# Altium project AutoCatFeederPCB.PrjPcb
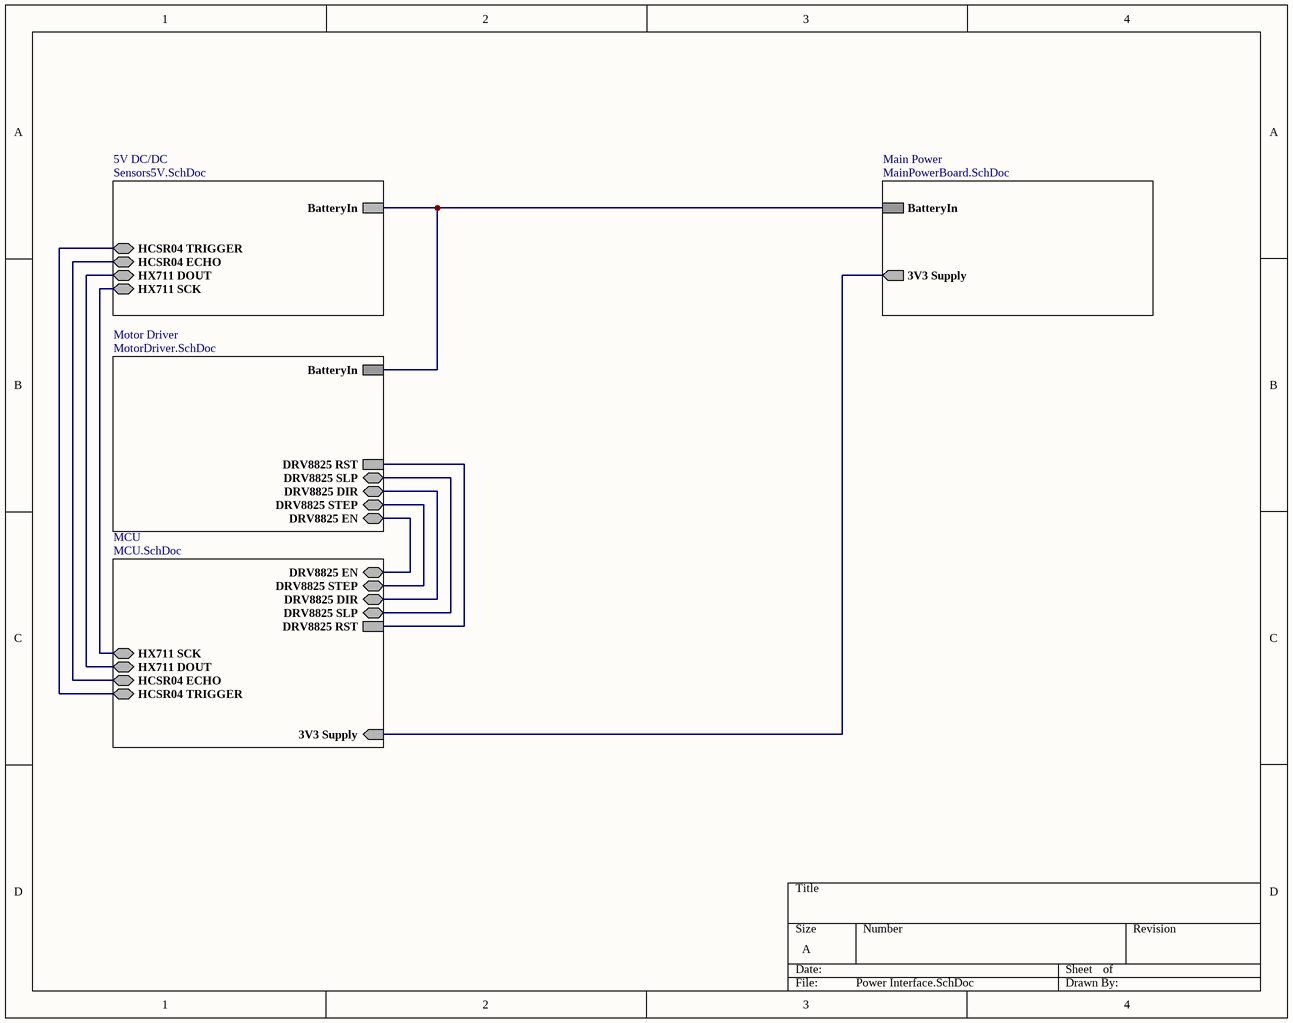
[diagram p0: Power Interface.SchDoc]
6 sheets, 91 parts. Net scope: hierarchical (ports join the sheet entries above them; power ports are global).
Board file: PCB1.PcbDoc
Sheets:
  Power Interface.SchDoc
    5V DC/DC = Sensors5V.SchDoc
    Main Power = MainPowerBoard.SchDoc
    Motor Driver = MotorDriver.SchDoc
    MCU = MCU.SchDoc
  Rechargeable Circuit.SchDoc

## Sheet Power Interface.SchDoc
size A; SheetNumber: 1; SheetTotal: 5

### Sub-sheets
5V DC/DC = Sensors5V.SchDoc: BatteryIn, HX711 DOUT (bidir), HX711 SCK (bidir), HCSR04 ECHO (bidir), HCSR04 TRIGGER (bidir)
Main Power = MainPowerBoard.SchDoc: BatteryIn, 3V3 Supply (out)
MCU = MCU.SchDoc: 3V3 Supply (in), DRV8825 EN (bidir), DRV8825 STEP (bidir), DRV8825 SLP (bidir), DRV8825 DIR (bidir), DRV8825 RST, HX711 SCK (bidir), HX711 DOUT (bidir), HCSR04 ECHO (bidir), HCSR04 TRIGGER (bidir)
Motor Driver = MotorDriver.SchDoc: BatteryIn, DRV8825 EN (bidir), DRV8825 STEP (bidir), DRV8825 DIR (bidir), DRV8825 SLP (bidir), DRV8825 RST

### Nets
NetC4_2: sheet 5V DC/DC/BatteryIn, sheet Main Power/BatteryIn, sheet Motor Driver/BatteryIn
NetC11_1: sheet Main Power/3V3 Supply, sheet MCU/3V3 Supply
NetMD1_2: sheet Motor Driver/DRV8825 RST, sheet MCU/DRV8825 RST
NetMD1_12: sheet Motor Driver/DRV8825 EN, sheet MCU/DRV8825 EN
NetMD1_13: sheet Motor Driver/DRV8825 STEP, sheet MCU/DRV8825 STEP
NetMD1_14: sheet Motor Driver/DRV8825 DIR, sheet MCU/DRV8825 DIR
NetMD1_16: sheet Motor Driver/DRV8825 SLP, sheet MCU/DRV8825 SLP
NetMD1_26: sheet 5V DC/DC/HX711 DOUT, sheet MCU/HX711 DOUT
NetMD1_29: sheet 5V DC/DC/HCSR04 TRIGGER, sheet MCU/HCSR04 TRIGGER
NetMD1_30: sheet 5V DC/DC/HCSR04 ECHO, sheet MCU/HCSR04 ECHO
NetMD1_33: sheet 5V DC/DC/HX711 SCK, sheet MCU/HX711 SCK

## Sheet Sensors5V.SchDoc
size A; SheetNumber: 3; SheetTotal: 5
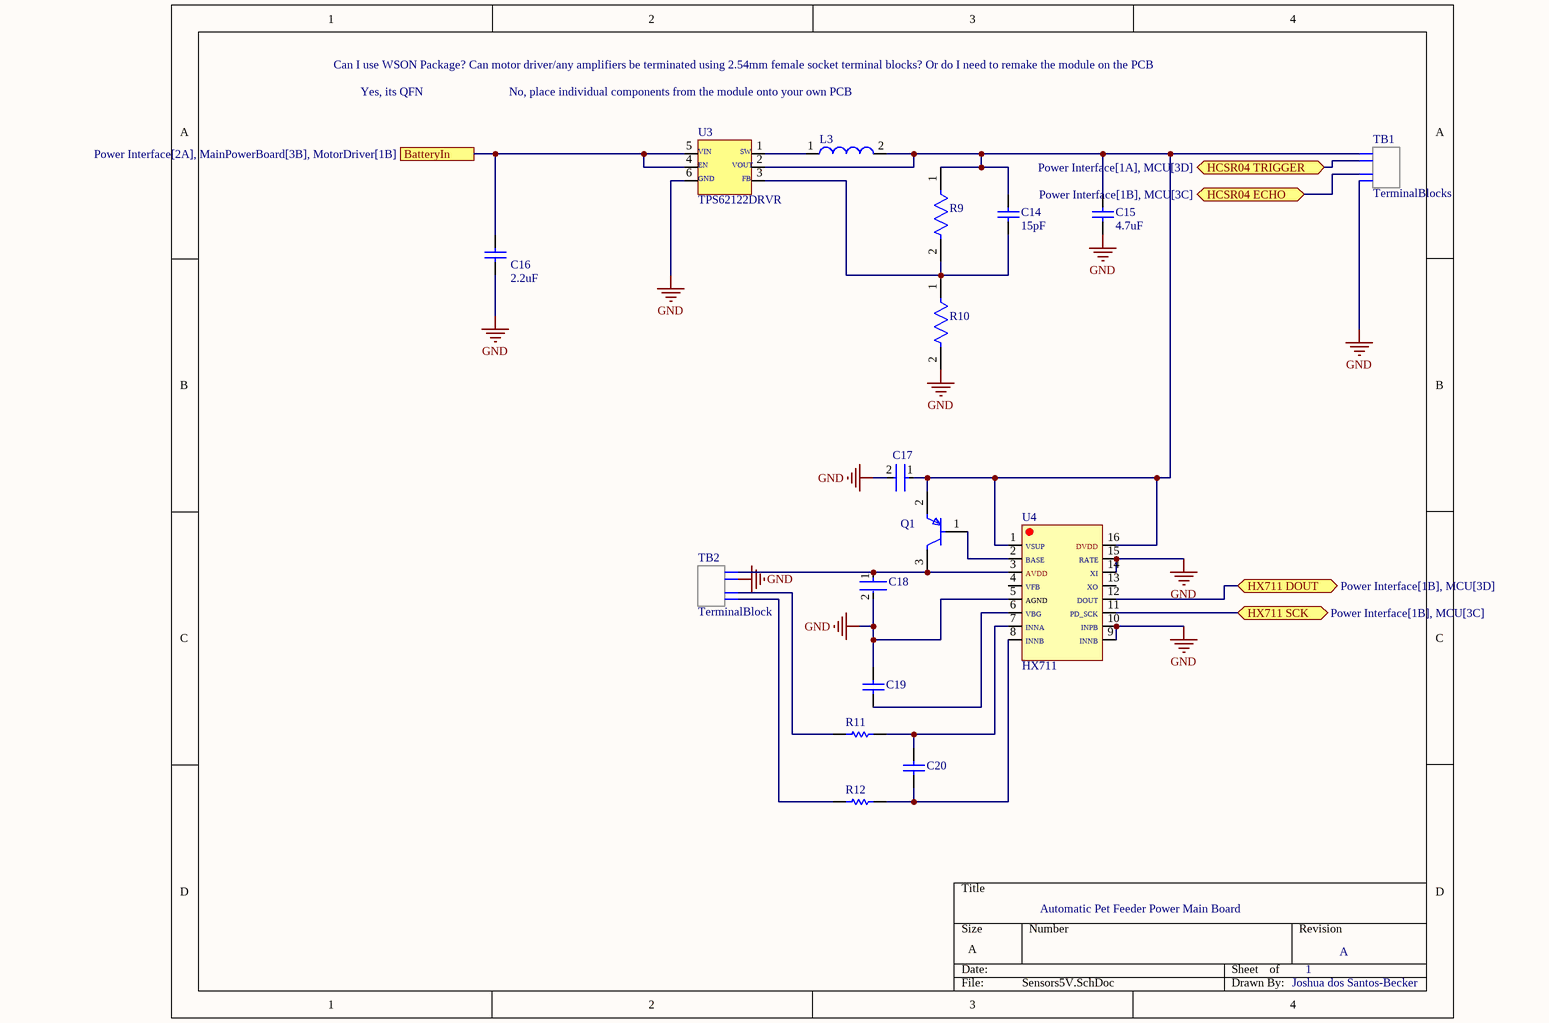
[diagram p1: Sensors5V.SchDoc]

### Parts
C14  15pF  [CAP_0805]
C15  4.7uF  [CAPC1005X06N]
C16  2.2uF  [CAPC0402X02N]
C17  GRM21BR61C106KE15L  [FP-GRM21B-0_1-IPC_C]  (value not drawn)
C18  GRM21BR61C106KE15L  [FP-GRM21B-0_1-IPC_C]  (value not drawn)
C19  GRM033C71C104KE14J  [CAPC0603X33N]  (value not drawn)
C20  GRM033C71C104KE14J  [CAPC0603X33N]  (value not drawn)
L3  (no value)  [FP-CB2012-IPC_A]
Q1  MMSS8550-H-TP  [FP-SOT-23-IPC_B]  (value not drawn)
R9  (no value)  [RESC0603(1608)_N]
R10  (no value)  [RESC1608X55X25LL10T15]
R11  ERJ-2RKF1000X  [RESC1005X40X25LL05T05]  (value not drawn)
R12  ERJ-2RKF1000X  [RESC1005X40X25LL05T05]  (value not drawn)
TB1  TerminalBlocks  [PHOENIX_1725672]
TB2  TerminalBlock  [PHOENIX_1725672]
U3  TPS62122DRVR  [PSON65P200X80_HS-7N]
U4  HX711  [TSOP127P600X160-16N]

### Ports
BatteryIn (see Power Interface[2A], MainPowerBoard[3B], MotorDriver[1B]), HCSR04 ECHO (bidir, see Power Interface[1B], MCU[3C]), HCSR04 TRIGGER (bidir, see Power Interface[1A], MCU[3D]), HX711 DOUT (bidir, see Power Interface[1B], MCU[3D]), HX711 SCK (bidir, see Power Interface[1B], MCU[3C])

### Nets
GND: C15.1 C16.1 C17.2 C18.2 C19.2 R10.2 TB1.4 TB2.3 U3.6 U4.5 U4.9 U4.10 U4.14 U4.15
NetC4_2: C16.2 U3.4 U3.5 ; port BatteryIn
NetC14_1: C14.1 R9.2 R10.1 U3.3
NetC14_2: C14.2 C15.2 C17.1 L3.2 Q1.2(E) R9.1 TB1.1 U3.2 U4.1 U4.16
NetC18_1: C18.1 Q1.3(C) TB2.4 U4.3
NetC19_1: C19.1 U4.6
NetC20_1: C20.1 R12.2 U4.8
NetC20_2: C20.2 R11.2 U4.7
NetL3_1: L3.1 U3.1
NetMD1_26: U4.12 ; port HX711 DOUT
NetMD1_29: TB1.2 ; port HCSR04 TRIGGER
NetMD1_30: TB1.3 ; port HCSR04 ECHO
NetMD1_33: U4.11 ; port HX711 SCK
NetQ1_1: Q1.1(B) U4.2
NetR11_1: R11.1 TB2.2
NetR12_1: R12.1 TB2.1

Not connected (* = marked no-connect by the designer): U4 4 13

### Notes on the sheet
- Can I use WSON Package? Can motor driver/any amplifiers be terminated using 2.54mm female socket terminal blocks? Or do I need to remake the module on the PCB
- Yes, its QFN
- No, place individual components from the module onto your own PCB
- Automatic Pet Feeder Power Main Board
- 1
- A
- Joshua dos Santos-Becker
- (in symbol HX711) VSUP; DVDD; BASE; RATE; AVDD; XI; VFB; XO; AGND; DOUT; VBG; PD_SCK; INNA; INPB; INNB
- (in symbol TPS6212) VIN; SW; EN; VOUT; GND; FB

### Library data of the parts
C14 = Cff: CC0805JRNPO9BN150
C15 = Cout2: GRM155R61A475MEAAD
C16 = Cin2: C1005X5R1V225K050BC
C17 C18 = CMP-2007-03453-2: Chip Multilayer Ceramic Capacitors for General Purpose, 0805, 10uF, X5R, 15%, 10%, 16V; Radiation Hardening: No; Thickness: 0.053inch; Voltage Rating (DC): 16V; Lead Free: Lead Free; Package Quantity: 1; Width: 1.25mm; Case Code (Imperial): 0805; Depth: 1.25mm; Packaging: Tape and Reel; Dielectric: X5R; Max Operating Temperature: 85°C; Tolerance: 10%; Voltage Rating: 16V; Voltage: 16V; Capacitance: 10uF; Height: 1.25mm; Case Code (Metric): 2012; Material: Ceramic; Mount: Surface Mount; Case/Package: 0805; REACH SVHC: No SVHC; Length: 2mm; Min Operating Temperature: -55°C; Termination: SMD/SMT
C19 C20 = 0.1uF: Manufacturer_Name: Murata Electronics; Geometry.Height: 0.33mm; Mouser Part Number: 81-GRM033C71C104KE4J; Mouser Price/Stock: https://www.mouser.co.uk/ProductDetail/Murata-Electronics/GRM033C71C104KE14J?qs=QzBtWTOodeU72T%252BpeIULSA%3D%3D; Manufacturer_Part_Number: GRM033C71C104KE14J; Datasheet Link: http://www.murata.com/~/media/webrenewal/support/library/catalog/products/capacitor/mlcc/c02e.pdf
L3 = L1: CBC2012T220M; Inductance: 22uH; Current Rating: 190mA; Self Resonant Frequency: 16MHz; DC Resistance (DCR): 4.81R; Tolerance: 20%; Max DC Current: 170mA; Shielding: Unshielded; Test Frequency: 2.52MHz; Core Material: Ferrite; Package Quantity: 3000; Height - Seated (Max): 0.057inch; Lead Free: Exempt; Width: 0.049inch; Length: 0.079inch; Max Operating Temperature: 105°C; Number of Pins: 2; Height: 1.25mm; Packaging: Tape and Reel; Saturation Current: 170mA; Mount: Surface Mount; Case Code (Metric): 2012; Series: CB; Halogen Free: Halogen Free; Min Operating Temperature: -40°C; Case Code (Imperial): 0805; Case/Package: 0805; Termination: SMD/SMT; RoHS Compliant: Yes; Resistor Type: Wirewound
Q1 = CMP-56214-000002-1: TRANS PNP 25V 1.5A SOT23; Emitter Base Voltage (VEBO): 1.6V; Collector Base Voltage (VCBO): 40V; Collector Emitter Saturation Voltage: 500mV; Max Power Dissipation: 625mW; Transition Frequency: 100MHz; Element Configuration: Single; hFE Min: 40; Polarity: PNP; Lead Free: Lead Free; Max Breakdown Voltage: 25V; Package Quantity: 1; Min Operating Temperature: -55°C; Case/Package: SOT-23; Max Collector Current: 1.5A; Mount: Surface Mount; Packaging: Tape and Reel; Collector Emitter Voltage (VCEO): 500mV; Max Operating Temperature: 150°C; Gain Bandwidth Product: 100MHz; Collector Emitter Breakdown Voltage: 25V
R9 = RES: RC0603FR-07430KL; Case-Metric: 1608; Power: 0.1 W; Case-EIA: 0603; Tolerance: 1 %; Value: 430000.00 Ohm; Technology: SMT
R10 = RES-2: RC0603FR-0782KL; Manufacturer: Yageo; Temperature Coefficient: 100PPM/C; Unit Weight: 0.000071oz; Voltage Rating: 75V; Resistance: 82kOhms; Power Rating: 100mW; Tolerance: 1%; Packaging: Reel; Package Description: 2-Pin Surface Mount Device, Body 1.6 x 0.8 mm; Package / Case: 0603(1608metric); Series: RC; Operating Temperature Range: -55Cto+155C; Brand: Yageo; Case Code - in: 0603; Width: 0.8mm; Height: 0.45mm; Product Category: ThickFilmResistors; Length: 1.6mm; Product: ThickFilmResistorsGeneralPurpose; Manufacturer URL: http://www.yageo.com/; Datasheet URL: http://www.yageo.com/documents/recent/PYu-RC_Group_51_RoHS_L_7.pdf; RoHS: True; Datasheet Version: Rev. 7, 05/2017; Case Code - mm: 1608; Package Reference: 0603; Mounting Technology: SurfaceMount; Type: GeneralPurposeChipResistorSurfaceMount; Termination Style: SMD/SMT
R11 R12 = CMP-2002-00605-3: Chip Resistor, 100 Ohm, +/- 1%, 100 mW, -55 to 155 degC, 0402 (1005 Metric), RoHS, Tape and Reel; Manufacturer: Basic Passives; Power Rating: 100 mW; Resistance: 100 Ohm; Voltage Rating: 50 V; Case\/Package: 0402; Width: 0.5 mm; Pins: 2; ComponentLink2Description: Datasheet; PackageReference: 0402; Height: 0.35 mm; Tolerance: 1%; DatasheetVersion: 04/2015; Case Code (Imperial): 0402; Min Operating Temperature: -55 degC; Radiation Hardening: No; Length: 1 mm; Package Quantity: 10000; PackageDescription: 2-Pin Surface Mount Device, Body 1 x 0.5 mm; Mounting Technology: Surface Mount; Case Code (Metric): 1005; Packaging: Tape and Reel; ComponentLink1URL: http://www.panasonic.com/; RoHSCompliant: true; Max Operating Temperature: 155 degC; REACH SVHC: Yes; PartNumber: ERJ-2RKF1000X; ComponentLink1Description: Manufacturer URL; ComponentLink2URL: http://industrial.panasonic.com/cdbs/www-data/pdf/RDA0000/AOA0000C86.pdf; Mount: Surface Mount
TB1 = TerminalBlock
U3 = TPS6212

## Sheet MainPowerBoard.SchDoc
size B; SheetNumber: 2; SheetTotal: 5
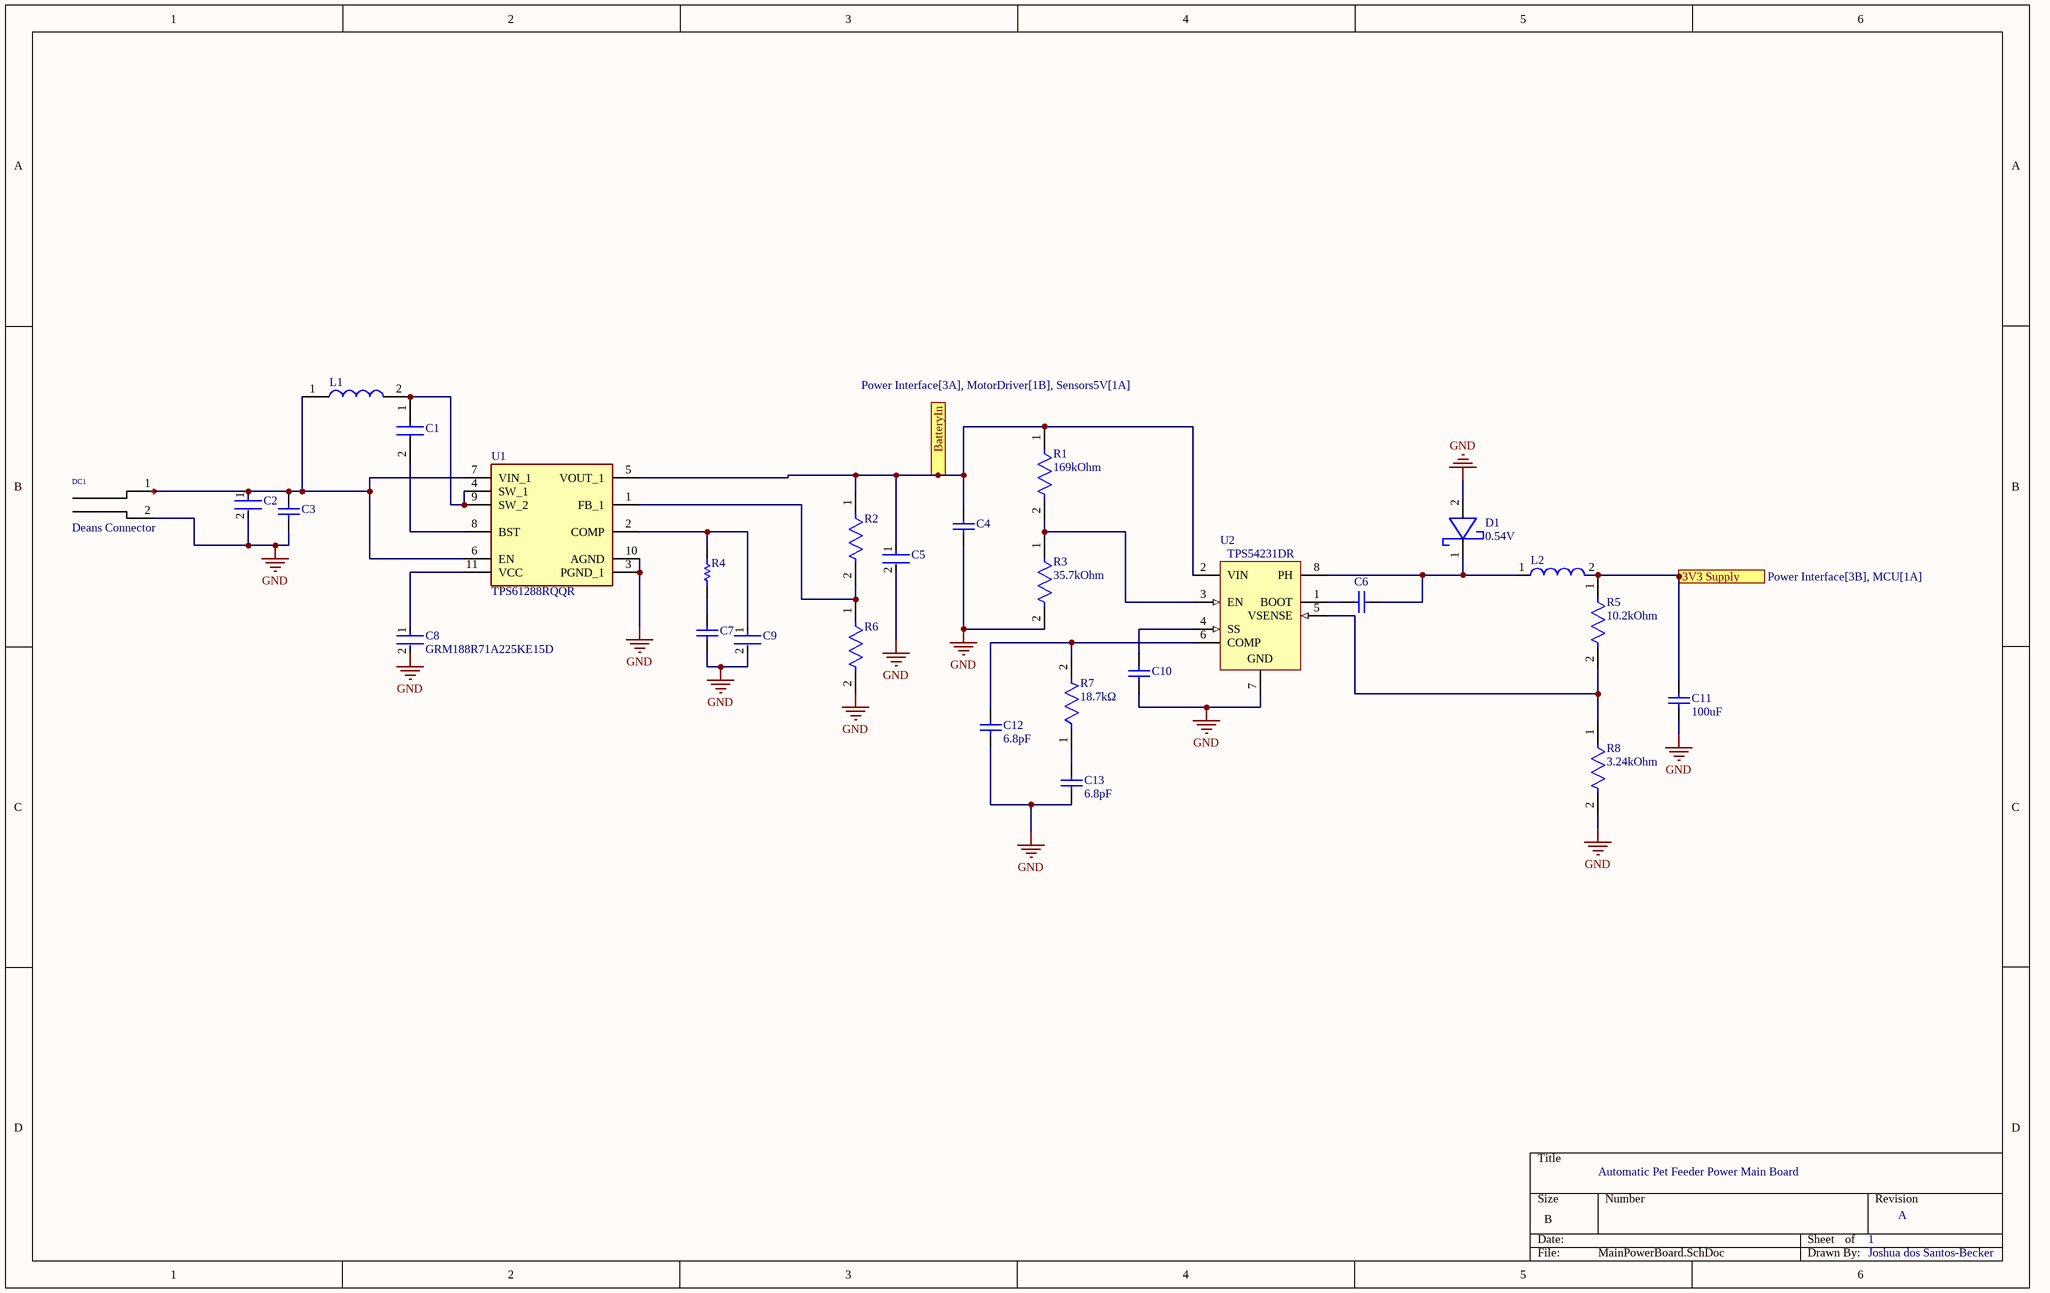
[diagram p2: MainPowerBoard.SchDoc]

### Parts
C1  EMK107B7104KA-T  [CAPC1608X95N]  (value not drawn)
C2  GRM188R60J106ME47D  [FP-GRM188-0_1-e0_2_0_55-IPC_A]  (value not drawn)
C3  GRM188R71H104KA93D  [CAPC1608X90X35ML10T15]  (value not drawn)
C4  (no value)  [FP-GRM32-IPC_A]
C5  GRM32ER61C476KE15L  [FP-GRM32E-0_3-0_2-IPC_C]  (value not drawn)
C6  (no value)  [CAPC1005X55X25LL05T10]
C7  GRM155R61A393KA01D  [CAPC1005X55X25NL05T10]  (value not drawn)
C8  GRM188R71A225KE15D  [FP-GRM188-0_1-e0_2_0_5-MFG]
C9  CL21C101JBANNNC  [FP-CL21-IPC_C]  (value not drawn)
C10  (no value)  [CAPC1005X55X25LL05T10]
C11  100uF  [CAP_0805]
C12  6.8pF  [Ccomp2]
C13  6.8pF  [Ccomp]
D1  0.54V  [SODFL260X100-2N]
DC1  Deans Connector  [Deans]
L1  XAL7070-222MEB  [XAL7070332MEB]  (value not drawn)
L2  (no value)  [WE-TI-L]
R1  169kOhm  [FP-CRCW0402-e3-IPC_B]
R2  CRCW0805931KFKEA  [RESC2012X50N]  (value not drawn)
R3  35.7kOhm  [FP-CRCW0402-e3-MFG]
R4  CRCW060339K2FKEA  [RESC1609X50X30LL10T20]  (value not drawn)
R5  10.2kOhm  [FP-CRCW0402-e3-MFG]
R6  CRCW080548K7FKEA  [FP-CRCW0805-e3-IPC_A]  (value not drawn)
R7  18.7kΩ  [FP-AC0402-IPC_A]
R8  3.24kOhm  [FP-CRCW0402-e3-MFG]
U1  TPS61288RQQR  [TPS61288RQQR]
U2  TPS54231DR  [D0008A_L]

### Ports
3V3 Supply (out, see Power Interface[3B], MCU[1A]), BatteryIn (see Power Interface[3A], MotorDriver[1B], Sensors5V[1A])

### Nets
GND: C2.2 C3.1 C4.1 C5.2 C7.2 C8.2 C9.2 C10.2 C11.2 C12.1 C13.2 D1.2 DC1.2 R3.2 R6.2 R8.2 U1.3(PGND_1) U1.10(AGND) U2.7(GND)
NetC1_1: C1.1 L1.2 U1.4(SW_1) U1.9(SW_2)
NetC1_2: C1.2 U1.8(BST)
NetC2_1: C2.1 C3.2 DC1.1 L1.1 U1.6(EN) U1.7(VIN_1)
NetC4_2: C4.2 C5.1 R1.1 R2.1 U1.5(VOUT_1) U2.2(VIN) ; port BatteryIn
NetC6_1: C6.1 U2.1(BOOT)
NetC6_2: C6.2 D1.1 L2.1 U2.8(PH)
NetC7_1: C7.1 R4.2
NetC8_1: C8.1 U1.11(VCC)
NetC9_1: C9.1 R4.1 U1.2(COMP)
NetC10_1: C10.1 U2.4(SS)
NetC11_1: C11.1 L2.2 R5.1 ; port 3V3 Supply
NetC12_2: C12.2 R7.2 U2.6(COMP)
NetC13_1: C13.1 R7.1
NetR1_2: R1.2 R3.1 U2.3(EN)
NetR2_2: R2.2 R6.1 U1.1(FB_1)
NetR5_2: R5.2 R8.1 U2.5(VSENSE)

### Notes on the sheet
- Automatic Pet Feeder Power Main Board
- 1
- A
- Joshua dos Santos-Becker

### Library data of the parts
C1 = EMK107B7104KA-T: Capacitor; Manufacturer_Name: TAIYO YUDEN; Datasheet Link: http://www.farnell.com/datasheets/746258.pdf; Height: 0.95mm; Manufacturer_Part_Number: EMK107B7104KA-T; Mouser Part Number: 963-EMK107B7104KA-T; Mouser Price/Stock: https://www.mouser.co.uk/ProductDetail/TAIYO-YUDEN/EMK107B7104KA-T?qs=I6KAKw0tg2ybqzX8hKPgfw%3D%3D; Arrow Part Number: EMK107B7104KA-T; Arrow Price/Stock: https://www.arrow.com/en/products/emk107b7104ka-t/taiyo-yuden
C2 = CMP-2006-02792-2: Chip Multilayer Ceramic Capacitors for General Purpose, 0603, 10uF, X5R, 15%, 20%, 6.3V; Packaging: Tape and Reel; Voltage Rating (DC): 6.3V; Width: 0.031inch; Termination: SMD/SMT; Dielectric: X5R; Package Quantity: 4000; Voltage Rating: 6.3V; Capacitance: 10uF; Case/Package: 0603; Min Operating Temperature: -55°C; Voltage: 6.3V; Length: 1.6mm; Thickness: 0.035inch; Lead Free: Lead Free; Depth: 0.8mm; Case Code (Imperial): 0603; Max Operating Temperature: 85°C; Material: Ceramic; Height: 0.8mm; Tolerance: 20%; Mount: Surface Mount; REACH SVHC: No SVHC; Radiation Hardening: No; Case Code (Metric): 1608
C3 = CMP-2100-03643-1: Chip Capacitor, 0.1 uF, +/- 10%, 50 V, -55 to 125 degC, 0603 (1608 Metric), RoHS, Tape and Reel; Manufacturer: Murata; Dielectric Material: Ceramic; Voltage Rating: 50V; Capacitance: 100nF; Dielectric: X7R; Insulation Resistance: 10GR; Case Code (Metric): 1608; Lead Free: LeadFree; Depth: 0.8mm; Number of Pins: 2; Radiation Hardening: No; Case/Package: 0603; Manufacturer URL: http://www.murata.com/; Packaging: TapeandReel; Length: 1.6mm; Contact Plating: Tin; Datasheet URL: http://psearch.en.murata.com/capacitor/product/GRM188R71H104KA93%23.pdf; Tolerance: 10%; Case Code (Imperial): 0603; Min Operating Temperature: -55degC; RoHSCompliant: true; Voltage: 50V; Termination: SMD/SMT; Mount: SurfaceMount; Material: Ceramic; Package Quantity: 1; Height: 0.8mm; Thickness: 0.035inch; REACH SVHC: NoSVHC; Max Operating Temperature: 125degC; Width: 0.8mm; Package Reference: 0603; Voltage Rating (DC): 50V; Datasheet Version: 42675.0; Package Description: 2-Pin Surface Mount Device, Body 1.6 x 0.8 mm
C4 = Cin: GRM32ER61E226KE15L; Manufacturer: Murata Electronics North America; Temperature Characteristic: X5R; Possible Substitute: GRM32ER61E226KE15K; Other Names: 490-3889-2; Material: Ceramic; Capacitance: 22uF; Value: 22uF; Voltage - Rated: 25V; Tolerance: 10%; Digikey Description: CAP CER 22UF 25V X5R 1210; Mouser Description: Multilayer Ceramic Capacitors MLCC - SMD/SMT 1210 22uF 25volts X5R 10%; Device Class L2: Capacitors; Height: 2.7mm; Category: Cap; RoHS: TRUE; Operating Temperature: -55°C ~ 85°C; Temperature: -55°C to +85°C; Lead Free: Yes; Package: GRM32; Temperature Range High: +85°C; Package / Case: 1210 (3225 Metric); Standard Package: 1,000; Packaging: Cut Tape (CT); Thickness (Max): 0.106" (2.70mm); Automotive: No; Device Class L1: Passive Components; Temperature Range Low: -55°C; Size / Dimension: 0.126" L x 0.098" W (3.20mm x 2.50mm); ComponentLink2Description: Datasheet; Device Class L3: Ceramic Capacitors; Temperature Coefficient: X5R; ComponentLink2URL: https://search.murata.co.jp/Ceramy/image/img/A01X/G101/ENG/GRM32ER61E226KE15-01A.pdf; Voltage Rating: 25V; Manufacturer Part Number: GRM32ER61E226KE15L; Octopart: https://octopart.com/grm32er61e226ke15l-murata-197441; Applications: General Purpose; Mounting Type: Surface Mount, MLCC
C5 = CMP-2000-06362-2: CAP CER 47UF 16V X5R 1210; Tolerance: 10%; Material: Ceramic; Case Code (Metric): 3225; RoHS Compliant: Yes; Min Operating Temperature: -55°C; Radiation Hardening: No; Voltage: 16V; Package Quantity: 1; Case Code (Imperial): 1210; REACH SVHC: No SVHC; Capacitance: 47uF; Voltage Rating (DC): 16V; Dielectric: X5R; Case/Package: 1210; Length: 3.2mm; Voltage Rating: 16V; Packaging: Cut Tape; Width: 0.098inch; Number of Pins: 2; Lead Free: Lead Free; Height: 2.5mm; Mount: Surface Mount; Termination: SMD/SMT; Max Operating Temperature: 85°C; Thickness: 0.106inch; Depth: 2.5mm
C6 = Cboot: GRM155R71A104KA01D; Manufacturer: Murata; Rated Voltage: 10V; Capacitance: 100000pF; Dielectric: X7R; Tolerance (%): ±10%; Manufacturer URL: http://www.murata.com/; Datasheet Version: 02/2016; Datasheet URL: http://search.murata.co.jp/Ceramy/image/img/A01X/G101/ENG/GRM155R71A104KA01-01.pdf; Package Reference: 0402; Package Description: 2-Pin Surface Mount Device, Body 1 x 0.5 mm; Mounting Technology: SurfaceMount; Case Size/Dimension: 0402
C7 = CMP-2008-04563-1: Manufacturer: Murata; Part Number: GRM155R61A393KA01D
C8 = CMP-2006-02836-2: Chip Multilayer Ceramic Capacitors for General Purpose, 0603, 2.2uF, X7R, 15%, 10%, 10V; Case Code (Metric): 1608; Height: 0.8mm; Packaging: Cut Tape; Voltage: 10V; Lead Free: Lead Free; Min Operating Temperature: -55°C; Voltage Rating (DC): 10V; Max Operating Temperature: 125°C; Voltage Rating: 10V; Dielectric: X7R; Depth: 0.8mm; Case Code (Imperial): 0603; Termination: SMD/SMT; Case/Package: 0603; Number of Pins: 2; REACH SVHC: No SVHC; Mount: Surface Mount; Width: 0.031inch; Material: Ceramic; Capacitance: 2.2uF; Package Quantity: 1; Weight: 7.1E-05oz; Length: 1.6mm; Thickness: 0.035inch; Tolerance: 10%
C9 = CMP-13271-001949-1: CL21 Series 0805 100pF 50V ±5% Tolerance C0G Multilayer Ceramic Chip Capacitor; Temperature Coefficient: 300ppm/°C; Voltage Rating (DC): 50V; Material: Ceramic; Capacitance: 100pF; Height: 0.65mm; Thickness: 0.03inch; Case/Package: 0805; Voltage Rating: 50V; Max Operating Temperature: 125°C; Voltage: 50V; Dielectric: C0G; Length: 2mm; Case Code (Metric): 2012; Packaging: Tape and Reel; Tolerance: 5%; Min Operating Temperature: -55°C; Radiation Hardening: No; Lead Free: Lead Free; Contact Plating: Tin; Width: 0.049inch; Mount: Surface Mount; Case Code (Imperial): 0805; Depth: 1.25mm
C10 = CSS: GRM155R71C822KA01D; Manufacturer: Murata; Part Number: GRM155R71C822KA01D
C11 = CAP_0805: Capacitor SMD 0805 Generic
C12 = Ccomp2: 06031U6R8BAT2A
C13 = Ccomp: 06031U6R8BAT2A
D1 = Schottky
L1 = XAL7070-222MEB: Inductor; Manufacturer_Name: COILCRAFT; Datasheet Link: https://www.coilcraft.com/xal7070.cfm; Height: 7mm; Manufacturer_Part_Number: XAL7070-222MEB; Mouser Part Number: 994-XAL7070-222MEB; Mouser Price/Stock: https://www.mouser.co.uk/ProductDetail/Coilcraft/XAL7070-222MEB?qs=VJjuEbE9QBOHvtnxhiSHKw%3D%3D
L2 = PAS-IND-INDUCTOR-2: 744772390; Inductance: 39.0 ÂµH; ComponentLink1Description: Manufacturer Link; ComponentLink1URL: http://www.we-online.com; PackageDescription: THT Inductor, 2-Leads, Body 7.8 x 7.8 mm; DatasheetVersion: ver 8, Oct-2009; ComponentLink2URL: http://www.we-online.de/katalog/media/pdf/744772390.pdf; PackageReference: WE-TI-L; PackageVersion: 2006; ComponentLink2Description: Datasheet
R1 = CMP-2002-08234-2: CRCW0402169KFKED; Max Power Dissipation: 63mW; Voltage Rating: 50V; Resistance: 169kR; Temperature Coefficient: 100ppm/°C; Tolerance: 1%; Max Operating Temperature: 155°C; Case/Package: 0402; Depth: 0.5mm; Number of Pins: 2; Lead Free: Lead Free; Radiation Hardening: No; Contact Plating: Tin; Width: 0.02inch; Number of Terminations: 2; Height: 0.35mm; Length: 1mm; Package Quantity: 10; Power Rating: 63mW; Packaging: Tape and Reel; Military Standard: Not; Case Code (Imperial): 0402; Weight: 2.3E-05oz; Voltage Rating (DC): 50V; Case Code (Metric): 1005; Composition: Thick Film; Features: Automotive AEC-Q200; Termination: SMD/SMT; Mount: Surface Mount; Min Operating Temperature: -55°C
R2 = CRCW0805931KFKEA: Resistor; Manufacturer_Name: Vishay; Datasheet Link: http://www.vishay.com/docs/20035/dcrcwe3.pdf; Height: 0.5mm; Manufacturer_Part_Number: CRCW0805931KFKEA; Mouser Part Number: 71-CRCW0805-931K-E3; Mouser Price/Stock: https://www.mouser.com/Search/Refine.aspx?Keyword=71-CRCW0805-931K-E3
R3 = CMP-2002-08543-2: CRCW040235K7FKED; Tolerance: 1%; Voltage Rating (DC): 50V; Power Rating: 63mW; Resistance: 35.7kR; Temperature Coefficient: 100ppm/°C; Case Code (Metric): 1005; Voltage Rating: 50V; Termination: SMD/SMT; Height: 0.35mm; Working Voltage: 50V; Width: 0.02inch; Min Operating Temperature: -55°C; Features: Automotive AEC-Q200; Radiation Hardening: No; Case/Package: 0402; Depth: 0.5mm; Lead Free: Lead Free; Contact Plating: Tin; Max Power Dissipation: 63mW; Max Operating Temperature: 155°C; Weight: 2.3E-05oz; Number of Pins: 2; Packaging: Tape and Reel; Number of Terminations: 2; Composition: Thick Film; Length: 1mm; Military Standard: Not; Package Quantity: 10; Case Code (Imperial): 0402
R4 = CMP-2000-03290-1: Manufacturer: Vishay Dale; Part Number: CRCW060339K2FKEA
R5 = CMP-2002-08138-2: CRCW040210K2FKED; Temperature Coefficient: 100ppm/°C; Power Rating: 63mW; Voltage Rating: 50V; Resistance: 10.2kR; Tolerance: 1%; Height: 0.35mm; Features: Automotive AEC-Q200; Contact Plating: Tin; Radiation Hardening: No; Width: 0.5mm; Case/Package: 0402; Depth: 0.5mm; Termination: SMD/SMT; Mount: Surface Mount; Packaging: Tape and Reel; Min Operating Temperature: -55°C; Package Quantity: 10; Number of Pins: 2; Composition: Thick Film; Length: 1mm; Max Power Dissipation: 63mW; Case Code (Imperial): 0402; Military Standard: Not; Case Code (Metric): 1005; Number of Terminations: 2; Weight: 2.3E-05oz; Max Operating Temperature: 155°C
R6 = CMP-2001-03948-2: RES Thick Film, 48.7kΩ, 1%, 0.125W, 100ppm/°C, 0805; Voltage Rating: 150V; Resistance: 48.7kR; Max Power Dissipation: 125mW; Military Standard: Not; Termination: SMD/SMT; Contact Plating: Tin; Min Operating Temperature: -55°C; Case Code (Metric): 2012; Width: 0.049inch; Temperature Coefficient: 100ppm/°C; Length: 2mm; Depth: 1.25mm; Packaging: Tape and Reel; Weight: 0.000194oz; Features: Automotive AEC-Q200; Number of Pins: 2; Max Operating Temperature: 155°C; Number of Terminations: 2; Case/Package: 0805; Lead Free: Lead Free; Tolerance: 1%; Case Code (Imperial): 0805; Package Quantity: 10; Voltage Rating (DC): 150V; Radiation Hardening: No; Power Rating: 125mW; Composition: Thick Film; Height: 0.45mm
R7 = CMP-03412-024020-2: AC0402FR-0718K7L; Tolerance: 1%; Max Power Dissipation: 63mW; Temperature Coefficient: 100ppm/°C; Resistance: 18.7kR; Resistor Type: Thick Film; Height: 0.015inch; Case/Package: 0402; Features: Moisture Resistant; Number of Terminations: 2; Min Operating Temperature: -55°C; Length: 0.039inch; RoHS Compliant: Yes; Packaging: Tape and Reel; Width: 0.02inch; Series: AC; Max Operating Temperature: 155°C
R8 = CMP-2002-08579-2: CRCW04023K24FKED; Voltage Rating: 50V; Max Power Dissipation: 63mW; Tolerance: 1%; Resistance: 3.24kR; Temperature Coefficient: 100ppm/°C; Packaging: Tape and Reel; Composition: Thick Film; Depth: 0.5mm; Weight: 2.3E-05oz; Number of Terminations: 2; Radiation Hardening: No; Voltage Rating (DC): 50V; Lead Free: Lead Free; Case Code (Metric): 1005; Height: 0.35mm; Width: 0.5mm; Max Operating Temperature: 155°C; Mount: Surface Mount; Package Quantity: 10; Number of Pins: 2; Min Operating Temperature: -55°C; Features: Automotive AEC-Q200; Case Code (Imperial): 0402; Power Rating: 63mW; Military Standard: Not; Contact Plating: Tin; Length: 1mm; Case/Package: 0402; Termination: SMD/SMT
U2 = CMP-0323-00207-3: Buck Step Down Regulator with 3.5 to 28 V Input and 0.8 to 25 V Output, -40 to 150 degC, 8-Pin SOIC (D), Green (RoHS & no Sb/Br); Manufacturer: Texas Instruments; Vout(Min)(V): 0.8; Iout(Max)(A): 2; SubFamily: Step-Down Regulator; Vin(Min)(V): 3.5; Rating: Catalog; Duty Cycle(Max)(%): 90; Switch Current Limit(Typ)(A): 2.3; Iq(Typ)(mA): 0.11; Regulated Outputs(#): 1; Vout(Max)(V): 25; Vin(Max)(V): 28; ComponentLink2Description: Package Specification; PackageVersion: revM, Jun-2011; Topology: Buck; PackageReference: D0008A; DatasheetVersion: SLUS851C; Code_JEDEC: MS-012AA; PartNumber: TPS54231DR; ComponentLink2URL: http://www.ti.com/litv/pdf/msoi002j; Eco-Plan: Green (RoHS & no Sb/Br); ComponentLink1URL: http://www.ti.com/general/docs/lit/getliterature.tsp?genericPartNumber=TPS54231&fileType=pdf; ComponentLink1Description: Datasheet; PackageDescription: 8-Pin Plastic Small Outline Integrated Circuit, 4.9 x 3.9 mm, Pitch 1.27 mm Pitch; ComponentLink3URL: Samples URL:http://www.ti.com/product/tps54231#samples; Mounting Technology: Surface Mount; ComponentLink3Description: URL Link1

## Sheet MotorDriver.SchDoc
size A; SheetNumber: 4; SheetTotal: 5
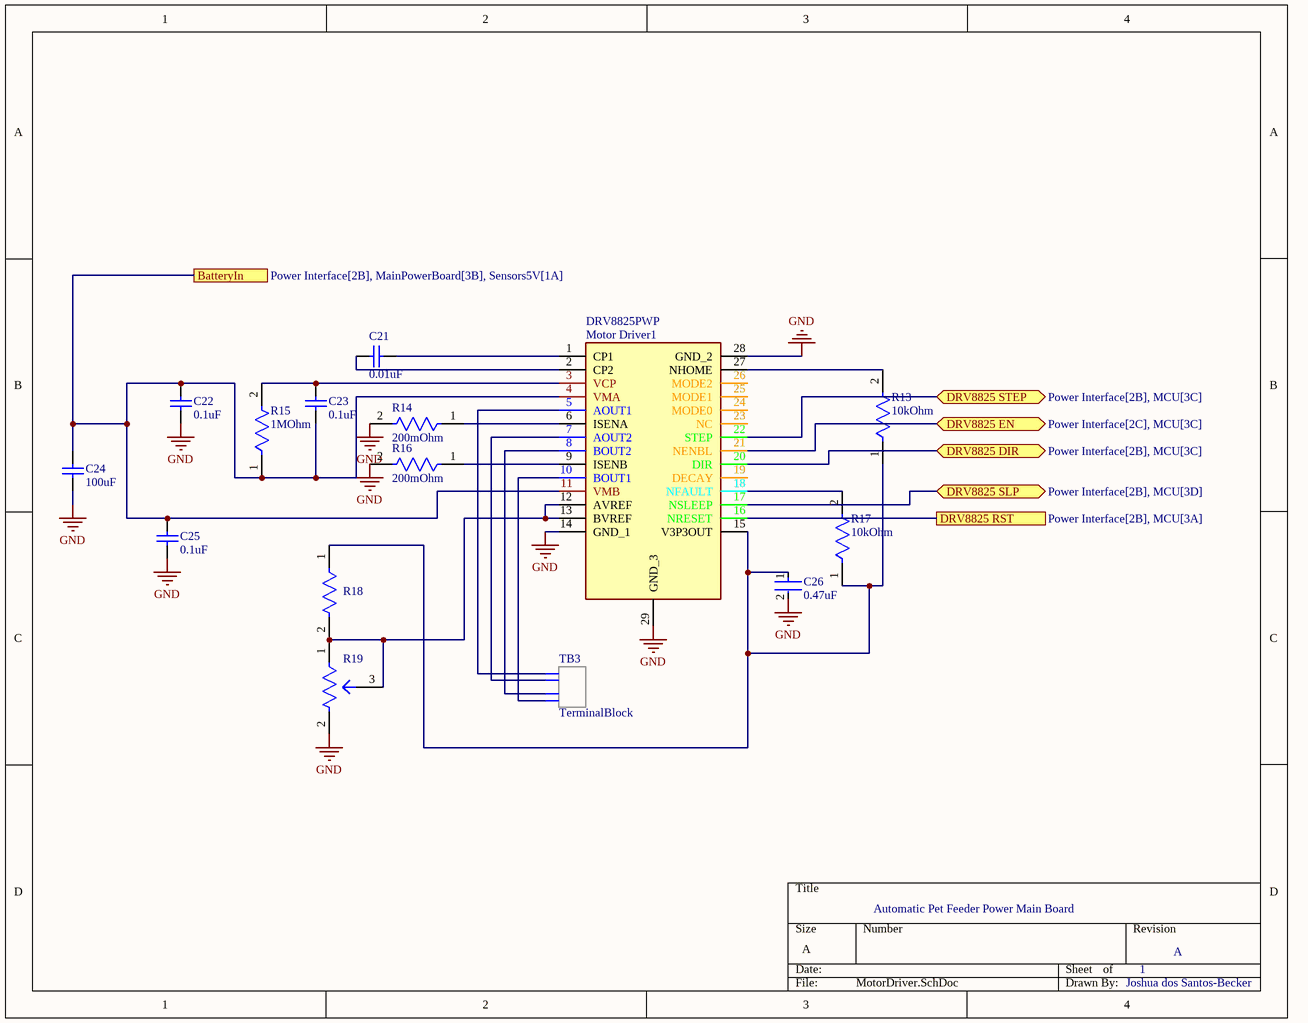
[diagram p3: MotorDriver.SchDoc]

### Parts
(Parts that share a designator on the sheet are numbered #1, #2 ... from top to bottom, then left to right.)
C21  0.01uF  [FP-C0603-030-0_03-IPC_A]
C22#1  0.1uF  [CAPC0603X33N]
C23#1  0.1uF  [CAPC0603X33N]
C24#1  100uF  [CAPC3225X279N]
C25#1  0.1uF  [CAPC0603X33N]
C26#1  0.47uF  [FP-1206-L_3_2_0_2-W_1_6_0-MFG]
Motor_Driver1  DRV8825PWP  [SOP65P640X120-29N]
R13  10kOhm  [FP-ESR10-IPC_C]
R14  200mOhm  [WSL2512R2000FEA]
R15  1MOhm  [RESC1005X40N]
R16  200mOhm  [WSL2512R2000FEA]
R17  10kOhm  [FP-ESR10-IPC_C]
R18  (no value)  [RESC1005X40N]
R19  (no value)  [SMD Pot]
TB3  TerminalBlock  [PHOENIX_1725672]

### Ports
BatteryIn (see Power Interface[2B], MainPowerBoard[3B], Sensors5V[1A]), DRV8825 DIR (bidir, see Power Interface[2B], MCU[3C]), DRV8825 EN (bidir, see Power Interface[2C], MCU[3C]), DRV8825 RST (see Power Interface[2B], MCU[3A]), DRV8825 SLP (bidir, see Power Interface[2B], MCU[3D]), DRV8825 STEP (bidir, see Power Interface[2B], MCU[3C])

### Nets
GND: C22#1.1 C24#1.1 C25#1.1 C26#1.2 Motor_Driver1.14(GND_1) Motor_Driver1.28(GND_2) Motor_Driver1.29(GND_3) R14.2 R16.2 R19.2
NetC4_2: C22#1.2 C23#1.1 C24#1.2 C25#1.2 Motor_Driver1.4(VMA) Motor_Driver1.11(VMB) R15.1 ; port BatteryIn
NetC21_1: C21.1 Motor_Driver1.1(CP1)
NetC21_2: C21.2 Motor_Driver1.2(CP2)
NetC23#1_2: C23#1.2 Motor_Driver1.3(VCP) R15.2
NetC26#1_1: C26#1.1 Motor_Driver1.15(V3P3OUT) R13.1 R17.1 R18.1
NetMD1_2: Motor_Driver1.16(NRESET) ; port DRV8825 RST
NetMD1_12: Motor_Driver1.21(NENBL) ; port DRV8825 EN
NetMD1_13: Motor_Driver1.22(STEP) ; port DRV8825 STEP
NetMD1_14: Motor_Driver1.20(DIR) ; port DRV8825 DIR
NetMD1_16: Motor_Driver1.17(NSLEEP) ; port DRV8825 SLP
NetMotor_Driver1_5: Motor_Driver1.5(AOUT1) TB3.1
NetMotor_Driver1_6: Motor_Driver1.6(ISENA) R14.1
NetMotor_Driver1_7: Motor_Driver1.7(AOUT2) TB3.2
NetMotor_Driver1_8: Motor_Driver1.8(BOUT2) TB3.3
NetMotor_Driver1_9: Motor_Driver1.9(ISENB) R16.1
NetMotor_Driver1_10: Motor_Driver1.10(BOUT1) TB3.4
NetMotor_Driver1_12: Motor_Driver1.12(AVREF) Motor_Driver1.13(BVREF) R18.2 R19.1 R19.3
NetMotor_Driver1_18: Motor_Driver1.18(NFAULT) R17.2
NetMotor_Driver1_27: Motor_Driver1.27(NHOME) R13.2

Not connected (* = marked no-connect by the designer): Motor_Driver1 19(DECAY) 23(NC) 24(MODE0) 25(MODE1) 26(MODE2)

### Notes on the sheet
- Automatic Pet Feeder Power Main Board
- 1
- A
- Joshua dos Santos-Becker

### Library data of the parts
C21 = 0.01uF: C0603X5R1C103M030BA; Voltage Rating (DC): 16V; Capacitance: 10nF; Dielectric Material: Ceramic; Dielectric: X5R; Tolerance: 20%; Length: 0.024inch; Max Operating Temperature: 85°C; Min Operating Temperature: -55°C; Case/Package: 0201; Packaging: Tape and Reel; Lead Free: Lead Free; Mount: Surface Mount; Package Quantity: 15000; Case Code (Imperial): 0201; Width: 0.012inch; RoHS Compliant: Yes; Weight: 6E-06oz; Voltage Rating: 16V; Height: 0.3mm; Thickness: 0.013inch; Case Code (Metric): 0603; Termination: SMD/SMT
C22#1 C23#1 C25#1 = 0.1uF: GRM033C71C104KE14J; Manufacturer_Name: Murata Electronics; Geometry.Height: 0.33mm; Mouser Part Number: 81-GRM033C71C104KE4J; Mouser Price/Stock: https://www.mouser.co.uk/ProductDetail/Murata-Electronics/GRM033C71C104KE14J?qs=QzBtWTOodeU72T%252BpeIULSA%3D%3D; Manufacturer_Part_Number: GRM033C71C104KE14J; Datasheet Link: http://www.murata.com/~/media/webrenewal/support/library/catalog/products/capacitor/mlcc/c02e.pdf
C24#1 = 100uF: 1210YD107MAT2A
C26#1 = CMP-04427-014563-1: 12065C474K4Z2A; Capacitance: 470nF; Voltage Rating (DC): 50V; Tolerance: 10%; Dielectric: X7R; RoHS Compliant: Yes; Radiation Hardening: No; Case Code (Metric): 3216; Mount: Surface Mount; Min Operating Temperature: -55°C; Features: Soft Termination; Case Code (Imperial): 1206; Thickness: 0.06inch; Max Operating Temperature: 125°C; Case/Package: 1206; Length: 0.126inch; Depth: 1.6mm; Packaging: Tape and Reel; Series: FLEXITERM®; Ratings: AEC-Q200; Width: 0.063inch; Voltage Rating: 50V
Motor_Driver1 = DRV8825PWP: 2.5A Stepper Motor Driver HTSSOP28 Texas Instruments DRV8825PWP, Stepper Motor Driver, 28-Pin HTSSOP; Geometry.Height: 1.2mm; Mouser Part Number: 595-DRV8825PWP; Mouser Price/Stock: https://www.mouser.co.uk/ProductDetail/Texas-Instruments/DRV8825PWP?qs=L4ss%2FyqpMWT%252BKNufX9tf3Q%3D%3D; Manufacturer_Name: Texas Instruments; Manufacturer_Part_Number: DRV8825PWP; Datasheet Link: http://www.ti.com/lit/ds/symlink/drv8825.pdf
R13 R17 = CMP-08839-028179-1: ESR10EZPD1002; RoHS Compliant: Yes
R14 R16 = 200mOhm: WSL2512R2000FEA
R15 = 1MOhm: CRCW04021M00FKEDHP
R18 = 50kOhm: CRCW040250K0FKED
R19 = 30kPot: TC33X-2-303E Bourns

## Sheet MCU.SchDoc
size A; SheetNumber: 5; SheetTotal: 5
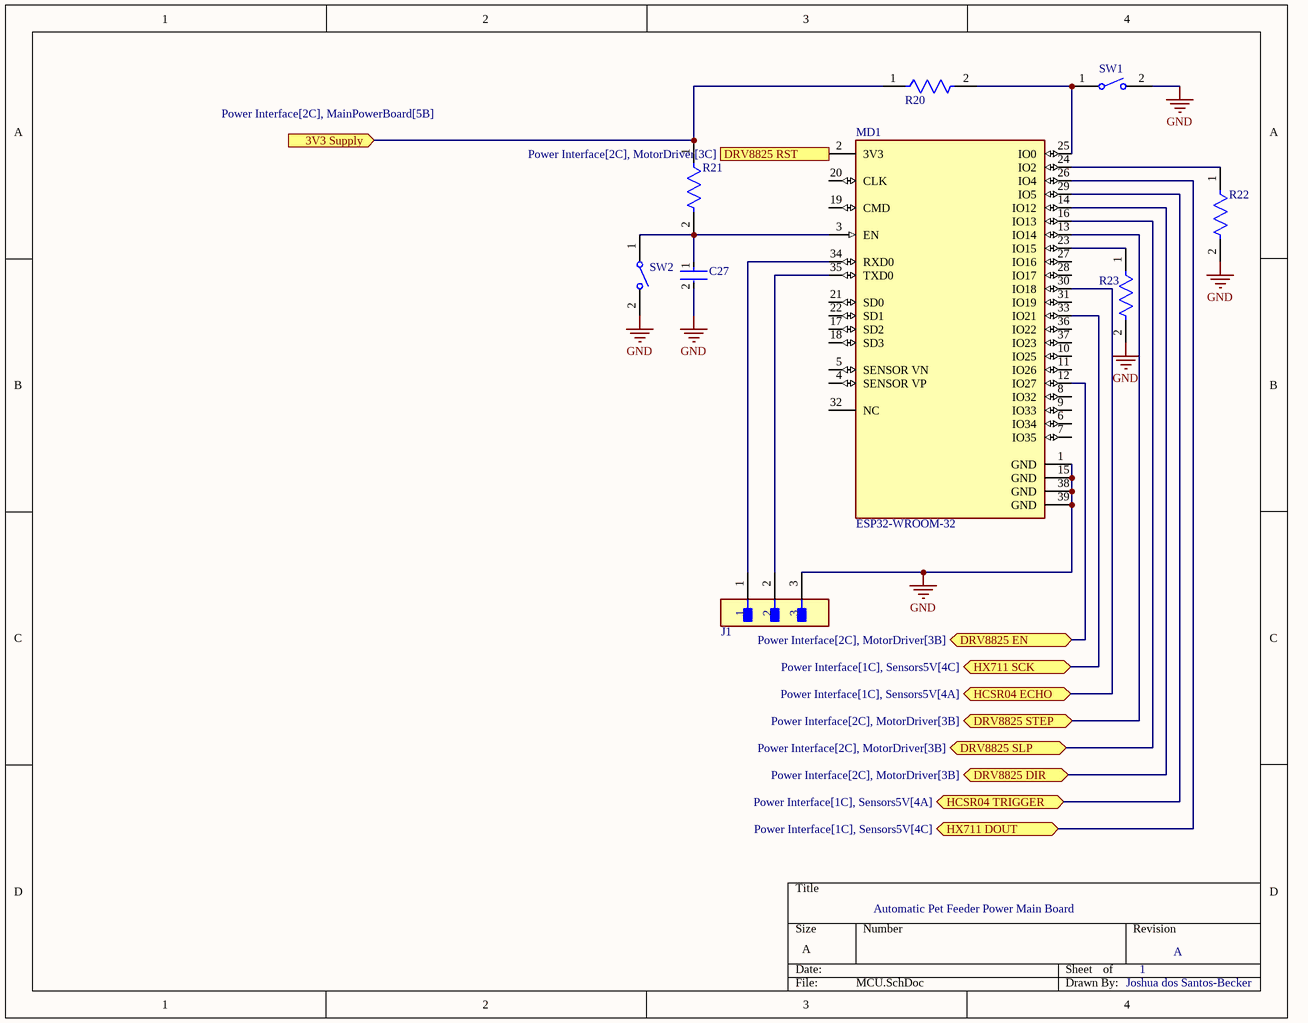
[diagram p4: MCU.SchDoc]

### Parts
(Parts that share a designator on the sheet are numbered #1, #2 ... from top to bottom, then left to right.)
C27#1  08055C104J4T2A  [FP-0805-L_2_01_0_2-W_1_25-MFG]  (value not drawn)
J1  PREC003SAAN-RC  [FP-PREC003SAAN-RC-MFG]  (value not drawn)
MD1  ESP32-WROOM-32  [FP-ESP32-WROOM-32-MFG]
R20  ESR10EZPD1002  [FP-ESR10-IPC_C]  (value not drawn)
R21  ESR10EZPD1002  [FP-ESR10-IPC_C]  (value not drawn)
R22  ESR10EZPD1002  [FP-ESR10-IPC_C]  (value not drawn)
R23  ESR10EZPD1002  [FP-ESR10-IPC_C]  (value not drawn)
SW1  FSMSM  [TECO-FSMSM-2_V]  (value not drawn)
SW2  FSMSM  [TECO-FSMSM-2_V]  (value not drawn)

### Ports
3V3 Supply (in, see Power Interface[2C], MainPowerBoard[5B]), DRV8825 DIR (bidir, see Power Interface[2C], MotorDriver[3B]), DRV8825 EN (bidir, see Power Interface[2C], MotorDriver[3B]), DRV8825 RST (see Power Interface[2C], MotorDriver[3C]), DRV8825 SLP (bidir, see Power Interface[2C], MotorDriver[3B]), DRV8825 STEP (bidir, see Power Interface[2C], MotorDriver[3B]), HCSR04 ECHO (bidir, see Power Interface[1C], Sensors5V[4A]), HCSR04 TRIGGER (bidir, see Power Interface[1C], Sensors5V[4A]), HX711 DOUT (bidir, see Power Interface[1C], Sensors5V[4C]), HX711 SCK (bidir, see Power Interface[1C], Sensors5V[4C])

### Nets
GND: C27#1.2 J1.3 MD1.1(GND) MD1.15(GND) MD1.38(GND) MD1.39(GND) R22.2 R23.2 SW1.2 SW2.2
NetC11_1: R20.1 R21.1 ; port 3V3 Supply
NetC27#1_1: C27#1.1 MD1.3(EN) R21.2 SW2.1
NetJ1_1: J1.1 MD1.34(RXD0)
NetJ1_2: J1.2 MD1.35(TXD0)
NetMD1_2: MD1.2(3V3) ; port DRV8825 RST
NetMD1_12: MD1.12(IO27) ; port DRV8825 EN
NetMD1_13: MD1.13(IO14) ; port DRV8825 STEP
NetMD1_14: MD1.14(IO12) ; port DRV8825 DIR
NetMD1_16: MD1.16(IO13) ; port DRV8825 SLP
NetMD1_23: MD1.23(IO15) R23.1
NetMD1_24: MD1.24(IO2) R22.1
NetMD1_25: MD1.25(IO0) R20.2 SW1.1
NetMD1_26: MD1.26(IO4) ; port HX711 DOUT
NetMD1_29: MD1.29(IO5) ; port HCSR04 TRIGGER
NetMD1_30: MD1.30(IO18) ; port HCSR04 ECHO
NetMD1_33: MD1.33(IO21) ; port HX711 SCK

Not connected (* = marked no-connect by the designer): MD1 4(SENSOR_VP) 5(SENSOR_VN) 6(IO34) 7(IO35) 8(IO32) 9(IO33) 10(IO25) 11(IO26) 17(SD2) 18(SD3) 19(CMD) 20(CLK) 21(SD0) 22(SD1) 27(IO16) 28(IO17) 31(IO19) 32(NC) 36(IO22) 37(IO23)

### Notes on the sheet
- Automatic Pet Feeder Power Main Board
- 1
- A
- Joshua dos Santos-Becker

### Library data of the parts
C27#1 = CMP-2007-04725-2: Automotive Ceramic Capacitor, 0805, 100nF, 5%, X7R, 15%, 50V; Dissipation Factor: 2.5%; Construction: Flat; Length: 2.01mm; Series: -; Tolerance: 5%; Number of Pins: 2; Termination: SMD/SMT; Packaging: Tape and Reel; Case/Package: 0805; Mount: Surface Mount; Depth: 1.25mm; Voltage Rating (DC): 50V; Package Quantity: 4000; RoHS Compliant: Yes; Ratings: AEC-Q200; Voltage Rating: 50V; Contact Plating: Tin; Width: 0.049inch; Height: 0.94mm; Dielectric: X7R; Case Code (Metric): 2012; Min Operating Temperature: -55°C; Lead Free: Lead Free; Radiation Hardening: No; Capacitance: 100nF; Thickness: 0.037inch; Max Operating Temperature: 125°C; Case Code (Imperial): 0805
J1 = CMP-00595-22265080-1: PREC003SAAN-RC Conn Header Vert 3POS 2.54MM; Number of Contacts: 3; Connector Type: Male Pin; Current Rating: 3A; Height: 8.74mm; Contact Mating Length: 5.842mm; Min Operating Temperature: -40°C; Termination: Solder; Packaging: Bulk; Pitch: 2.54mm; Color: Black; Mount: Through Hole; Contact Material: Nickel, Tin; Number of Rows: 1; NexarPartId: 22265080; Max Operating Temperature: 105°C; RoHS: Compliant; Contact Plating: Tin; Number of Positions: 3
MD1 = CMP-194065-000008-1: RX TXRX MOD WIFI SURFACE MOUNT; Frequency: 2.5GHz; Sensitivity: -98dBm; Operating Supply Voltage: 3.6V; Data Rate: 150Mbps; Weight: 0.088185oz; Package Quantity: 550; Min Operating Temperature: -40°C; Mount: Surface Mount; Max Operating Temperature: 85°C; Packaging: Cut Tape; Case/Package: SMD/SMT
R20-R23 = CMP-08839-028179-1: 10kΩ ±0.5% 0.4W 0805 Anti-Surge Chip Resistor AEC-Q200; RoHS Compliant: Yes
SW1 SW2 = CMP-2000-07511-1: FSMSM Push Button Switch, 50 mA, -35 to 85 degC, 2-Pin SMD, RoHS, Bulk; Manufacturer: TE Connectivity; Actuator Length: 1.07mm; Electrical Life: 20000Cycles; Actuator Material: Polyamide; Current Rating: 50mA; Illumination Type: Illuminated; Voltage Rating (DC): 24V; Contact Resistance: 100mOhm; Case\/Package: SMD/SMT; Operating Force: 180gf; Switch Travel: 0.25mm; Max Voltage Rating (DC): 12V; Throw Configuration: SPST; Packaging: LoosePiece; Max Operating Temperature: 85degC; ELV: Compliant; Package Description: 2-Pin Surface Mount Device, Body 6 x 3.5 mm, Pitch 9.19 mm; RoHSCompliant: true; Manufacturer URL: http://www.te.com/; Contact Plating: Silver; Contact Material: Brass; Mounting Technology: SurfaceMount; Contact Current Rating: 50mA; Datasheet Version: Rev. C2, 08/2014; Datasheet URL: http://www.te.com/commerce/DocumentDelivery/DDEController?Action=showdoc&DocId=Customer+Drawing%7F1437566-3%7FC2%7Fpdf%7FEnglish%7FENG_CD_1437566-3_C2_1437566_3_1_c.dwg.pdf%7F1437566-3; Mechanical Life: 20000Cycles; Package Reference: FSMSM; REACH SVHC: Unknown; Orientation: Straight; Min Operating Temperature: -35degC; Lead Free: LeadFree; Termination: GullWing; Package Quantity: 1000; Mount: SurfaceMount

## Sheet Rechargeable Circuit.SchDoc
size B; SheetNumber: 1; SheetTotal: 1
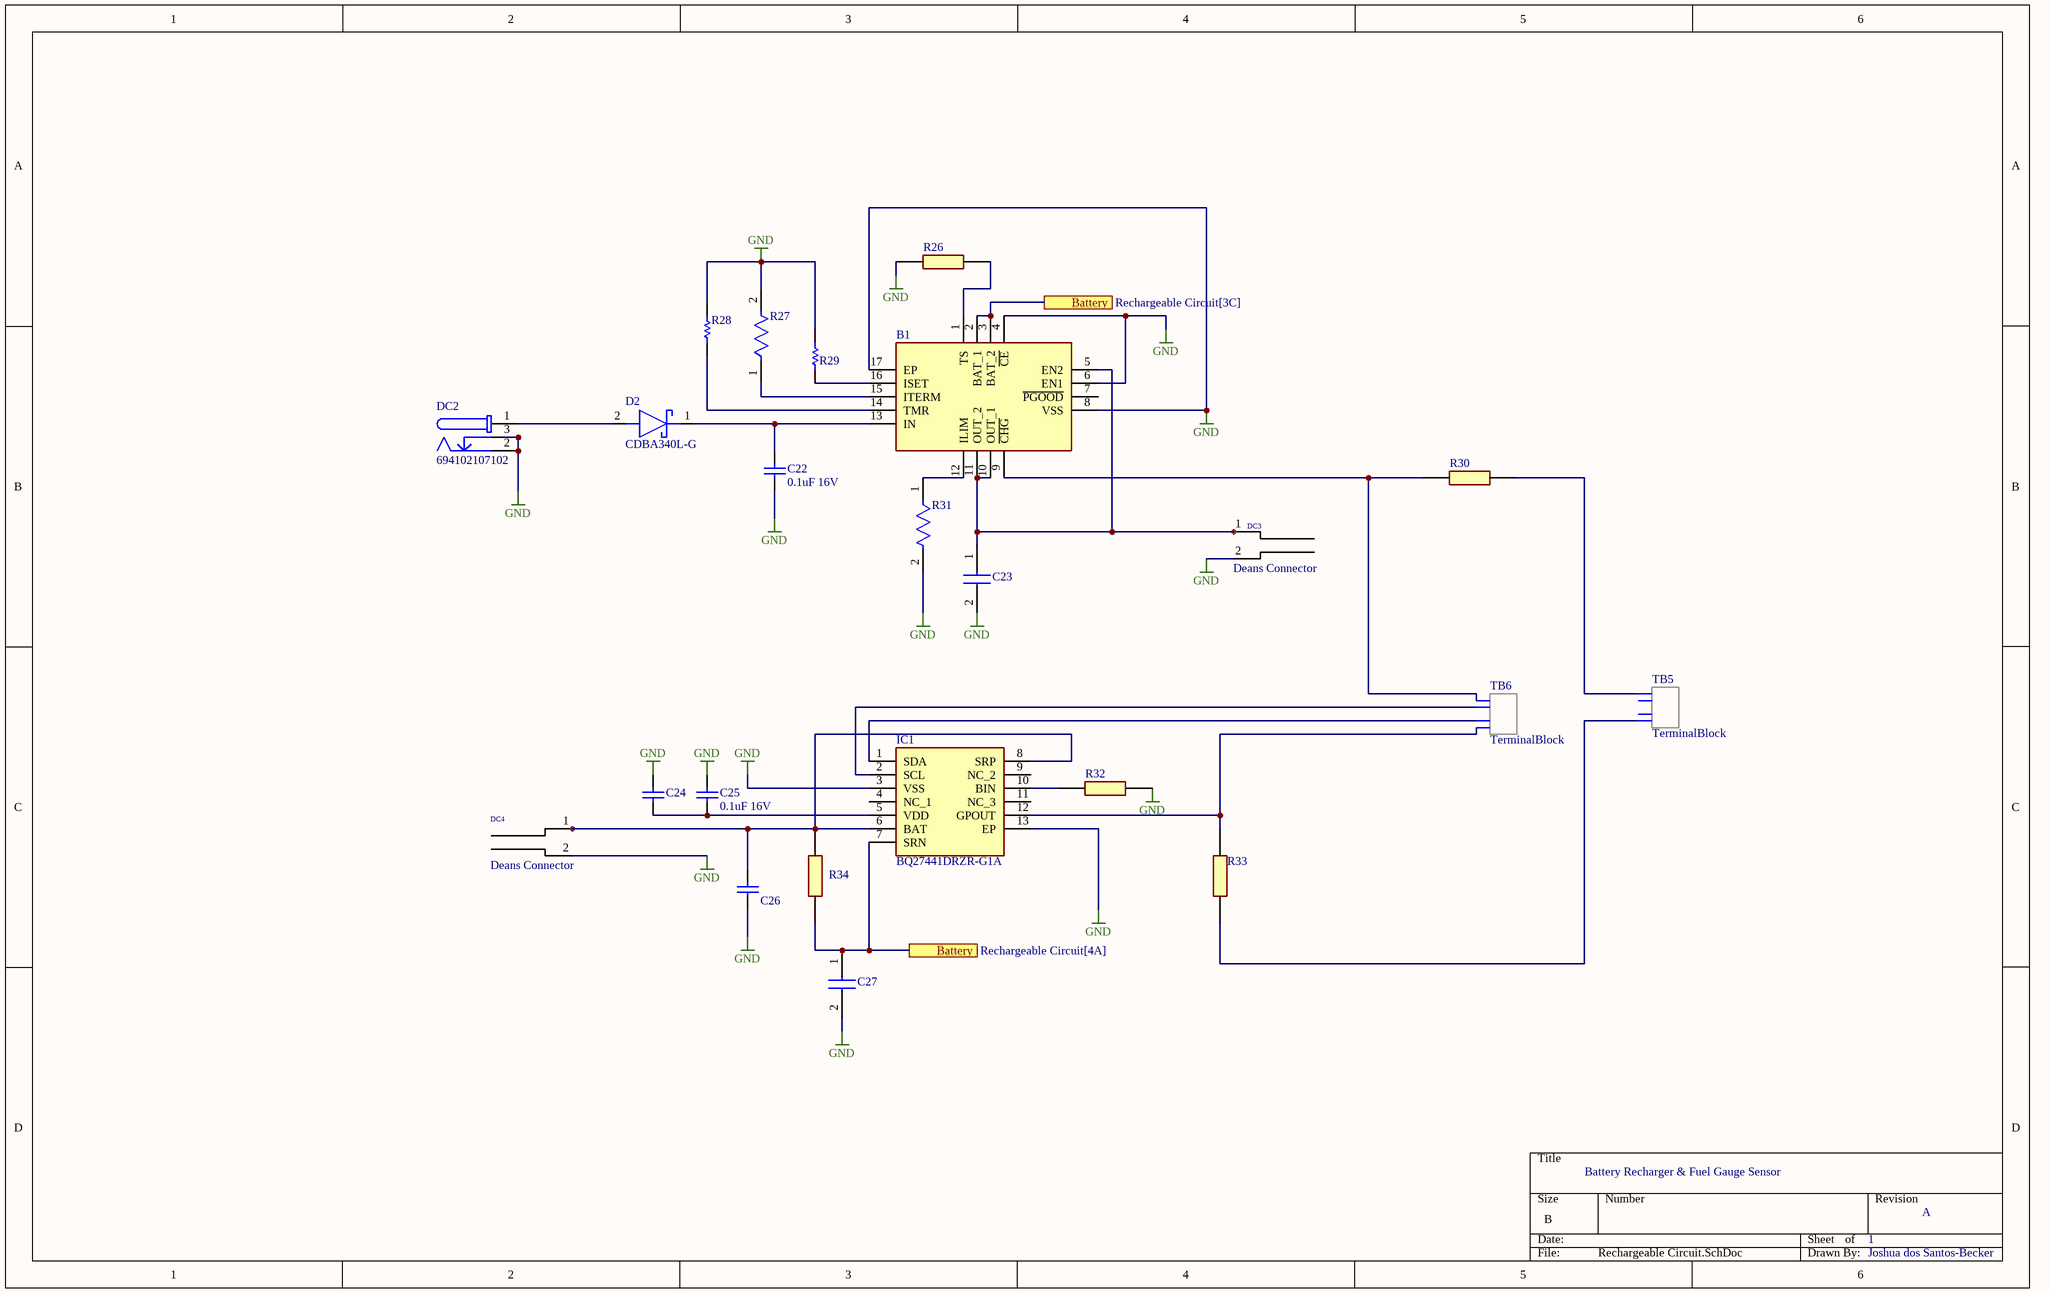
[diagram p5: Rechargeable Circuit.SchDoc]

### Parts
(Parts that share a designator on the sheet are numbered #1, #2 ... from top to bottom, then left to right.)
B1  BQ24232HRGTR  [QFN50P300X300X100-17N-D]  (value not drawn)
C22#2  0.1uF 16V  [CAPC2113X100X50ML30T10]
C23#2  GRM32DR71C106KA01L  [GRM32DR61C106KA01L]  (value not drawn)
C24#2  C1206C105K3RACTU  [CAPC3216X180X50ML20T25]  (value not drawn)
C25#2  0.1uF 16V  [CAPC2113X100X50ML30T10]
C26#2  C1206C105K3RACTU  [CAPC3216X180X50ML20T25]  (value not drawn)
C27#2  GRM32DR71C106KA01L  [GRM32DR61C106KA01L]  (value not drawn)
D2  CDBA340L-G  [DIONM5127X229N]
DC2  694102107102  [694102107102]
DC3  Deans Connector  [Deans]
DC4  Deans Connector  [Deans]
IC1  BQ27441DRZR-G1A  [BQ27441DRZRG1A]
R26  CRM2512QJW-103ELF  [RESC6331X80N]  (value not drawn)
R27  RG2012V-1431-B-T5  [FP-RG2012-MFG]  (value not drawn)
R28  CRCW120656K2FKEA  [RESC3216X60X45ML10T20]  (value not drawn)
R29  1K74 1% 2010(5025)  [RESC2010(5025)_L]  (value not drawn)
R30  CRM2512QJW-103ELF  [RESC6331X80N]  (value not drawn)
R31  CRCW08053K09FKEA  [FP-CRCW0805-e3-IPC_C]  (value not drawn)
R32  CRM2512QJW-103ELF  [RESC6331X80N]  (value not drawn)
R33  CRM2512QJW-103ELF  [RESC6331X80N]  (value not drawn)
R34  CRM2512QJW-103ELF  [RESC6331X80N]  (value not drawn)
TB5  TerminalBlock  [PHOENIX_1725672]
TB6  TerminalBlock  [PHOENIX_1725672]

### Ports
Battery (see Rechargeable Circuit[3C]), Battery (see Rechargeable Circuit[4A])

### Nets
GND: B1.4(~{CE}) B1.6(EN1) B1.8(VSS) B1.17(EP) C22#2.2 C23#2.2 C24#2.1 C25#2.1 C26#2.1 C27#2.2 DC2.2 DC2.3 DC3.2 DC4.2 IC1.3(VSS) IC1.13(EP) R26.1 R27.2 R28.1 R29.2 R31.2 R32.2
NetB1_1: B1.1(TS) R26.2
NetB1_2: B1.2(BAT_1) B1.3(BAT_2) C27#2.1 IC1.7(SRN) R34.1 ; port Battery
NetB1_5: B1.5(EN2) B1.10(OUT_1) B1.11(OUT_2) C23#2.1 DC3.1
NetB1_9: B1.9(~{CHG}) R30.1 TB6.1
NetB1_12: B1.12(ILIM) R31.1
NetB1_13: B1.13(IN) C22#2.1 D2.1(K)
NetB1_14: B1.14(TMR) R28.2
NetB1_15: B1.15(ITERM) R27.1
NetB1_16: B1.16(ISET) R29.1
NetC24#2_2: C24#2.2 C25#2.2 IC1.5(VDD)
NetC26#2_2: C26#2.2 DC4.1 IC1.6(BAT) IC1.8(SRP) R34.2
NetD2_2: D2.2(A) DC2.1
NetIC1_1: IC1.1(SDA) TB6.3
NetIC1_2: IC1.2(SCL) TB6.2
NetIC1_10: IC1.10(BIN) R32.1
NetIC1_12: IC1.12(GPOUT) R33.1 TB6.4
NetR30_2: R30.2 TB5.1
NetR33_2: R33.2 TB5.4

Not connected (* = marked no-connect by the designer): B1 7(~{PGOOD}); IC1 4(NC_1) 9(NC_2) 11(NC_3); TB5 2 3

### Notes on the sheet
- Battery Recharger & Fuel Gauge Sensor
- 1
- A
- Joshua dos Santos-Becker

### Library data of the parts
B1 = BQ24232HRGTR: USB-Friendly Lithium Based Battery Charger With Power-Path For 4.35V Batteries; Manufacturer_Name: Texas Instruments; Geometry.Height: 1mm; Mouser Part Number: 595-BQ24232HRGTR; Mouser Price/Stock: https://www.mouser.co.uk/ProductDetail/Texas-Instruments/BQ24232HRGTR?qs=sU0fTKI0LunTvrHzq76tZQ%3D%3D; Manufacturer_Part_Number: BQ24232HRGTR; Datasheet Link: http://www.ti.com/lit/gpn/bq24232h
C22#2 C25#2 = CMP-2007-00010-1: C0805X104K4RACTU; Manufacturer: Kemet; Part Number: C0805X104K4RACTU
C23#2 C27#2 = GRM32DR71C106KA01L: Capacitor; Manufacturer_Name: Murata Electronics; Datasheet Link: http://www.murata.com/~/media/webrenewal/support/library/catalog/products/capacitor/mlcc/c02e.pdf; Height: 2.2mm; Manufacturer_Part_Number: GRM32DR71C106KA01L; Mouser Part Number: 81-GRM32R71C106KA01L; Mouser Price/Stock: https://www.mouser.co.uk/ProductDetail/Murata-Electronics/GRM32DR71C106KA01L?qs=%2FV5QxPF79G3iRcxyZgnthw%3D%3D; Arrow Part Number: GRM32DR71C106KA01L; Arrow Price/Stock: https://www.arrow.com/en/products/grm32dr71c106ka01l/murata-manufacturing
C24#2 C26#2 = CMP-2000-04991-1: Chip Capacitor, 1 uF, +/- 10%, 25 V, -55 to 125 degC, 1206 (3216 Metric), RoHS, Tape and Reel; Manufacturer: Kemet; Temperature Coefficient / Code: +/-15%; Capacitance: 1uF; Dielectric: X7R; Voltage Rating DC: 25V; Capacitance - nF: 1000nF; Class: Class1; Case Length: 3.2mm; Type: SMDMLCCX7R6.3-250VDCCommericalGrade; Case Width: 1.6mm; Product: GeneralTypeMLCCs; Datasheet URL: https://ciiva.com/datasheet-click-18194173?src=ciiva&sig=6daff8c4; Operating Temperature Range: -55Cto+125C; Series: C1206C; RoHS: Details; Product Category: MultilayerCeramicCapacitorsMLCC-SMD/SMT; Manufacturer URL: http://www.kemet.com/; Minimum Operating Temperature: -55C; Dimensions: 1.6mmWx3.2mmLx1.6mmH; Termination Style: SMD/SMT; Brand: Kemet; Packaging: Reel; Package / Case: 1206(3216metric); Case Code - mm: 3216; Datasheet Version: Jul-14; Factory Pack Quantity: 2000; Package Description: 2-Pin Surface Mount Device, Body 3.2 x 1.6 mm; Tolerance: 10%; Package Reference: 1206; Case Height: 1.6mm; Case Code - in: 1206; Maximum Operating Temperature: +125C; Voltage Rating: 25V
D2 = CDBA340L-G: Schottky Diode; Manufacturer_Name: Comchip Technology; Datasheet Link: https://componentsearchengine.com/Datasheets/1/CDBA340L-G.pdf; Height: 2.29mm; Manufacturer_Part_Number: CDBA340L-G; Mouser Part Number: 750-CDBA340L-G; Mouser Price/Stock: https://www.mouser.co.uk/ProductDetail/Comchip-Technology/CDBA340L-G?qs=tw%252BuQ%2FB6PO0nFaxtl1KyCA%3D%3D; Arrow Part Number: CDBA340L-G; Arrow Price/Stock: https://www.arrow.com/en/products/cdba340l-g/comchip-technology?region=nac
DC2 = DC Power Jack: NexarPartId: 52645180; Connector Type: Power; Insulation Resistance: 100MΩ; Gender: Male; Current Rating: 5A; Voltage Rating: 18V; Shielding: Unshielded; Mount: Surface Mount; Packaging: Tape and Reel; Max Operating Temperature: 85°C; Color: Black; Contact Plating: Tin; Min Operating Temperature: -40°C; Housing Material: Polyamide; Termination: SMD/SMT; RoHS: Compliant; Contact Gender: Female; REACH SVHC: Unknown; Voltage Rating (DC): 18V; Operating Supply Voltage: 18V; Flammability Rating: UL94 V-0
IC1 = BQ27441DRZR-G1A: Integrated Circuit; Manufacturer_Name: Texas Instruments; Datasheet Link: http://www.ti.com/lit/gpn/bq27441-g1; Manufacturer_Part_Number: BQ27441DRZR-G1A; Mouser Part Number: 595-BQ27441DRZR-G1A; Mouser Price/Stock: https://www.mouser.co.uk/ProductDetail/Texas-Instruments/BQ27441DRZR-G1A?qs=vvk%2Fphg2gmMTlt0P9j2l8w%3D%3D; Arrow Part Number: BQ27441DRZR-G1A; Arrow Price/Stock: https://www.arrow.com/en/products/bq27441drzr-g1a/texas-instruments?region=nac
R26 R30 R32-R34 = CRM2512QJW-103ELF: ResPowerQ 2512 10k 5% 2W TC200; Manufacturer_Name: Bourns; Geometry.Height: 0.8mm; Mouser Part Number: 652-CRM2512QJW-103E; Mouser Price/Stock: https://www.mouser.co.uk/ProductDetail/Bourns/CRM2512QJW-103ELF?qs=8Wlm6%252BaMh8Rzg3bRHdWGsA%3D%3D; Manufacturer_Part_Number: CRM2512QJW-103ELF; Datasheet Link: http://www.bourns.com/data/global/pdfs/CRM0805_1206_2010.pdf
R27 = CMP-28537-000935-1: Automotive Metal Thin Film Chip Resistor, 0805, 1.43kΩ, 0.1%, 5ppm/°C, 0.125W, 150V; Power Rating: 125mW; Resistance: 1.43kR; Resistor Type: Thin Film; Package Quantity: 5000; Voltage Rating: 150V; Termination: SMD/SMT; Tolerance: 0.1%; Features: Automotive AEC-Q200; RoHS Compliant: Yes; Max Power Dissipation: 125mW; Weight: 0.000194oz; Series: RG; Case/Package: 0805; Height: 0.02inch; Width: 1.2mm; Lead Free: Lead Free; Min Operating Temperature: -55°C; Case Code (Metric): 2012; Temperature Coefficient: 5ppm/°C; Max Operating Temperature: 155°C; Packaging: Tape and Reel; Voltage Rating (DC): 150V; Number of Terminations: 2; Case Code (Imperial): 0805; Length: 0.079inch
R28 = CMP-2003-02284-1: Manufacturer: Vishay Dale; Part Number: CRCW120656K2FKEA
R29 = CMP-1017-00535-1: 1K74 0.75W 1% 2010 (5025 Metric)  SMD; Case-Metric: 5025; Case-EIA: 2010; Value: 1740.00 Ohm; Power: 0.75 W; Tolerance: 1 %; Technology: SMT
R31 = CMP-2001-03873-2: RES Thick Film, 3.09kΩ, 1%, 0.125W, 100ppm/°C, 0805; Max Power Dissipation: 125mW; Voltage Rating (DC): 150V; Resistance: 3.09kR; Power Rating: 125mW; Package Quantity: 10; Height: 0.02inch; Min Operating Temperature: -55°C; Number of Terminations: 2; Case Code (Metric): 2012; Case/Package: 0805; Composition: Thick Film; Max Operating Temperature: 155°C; Tolerance: 1%; Depth: 1.25mm; Number of Pins: 2; Packaging: Tape and Reel; Width: 0.049inch; Temperature Coefficient: 100ppm/°C; Voltage Rating: 150V; Military Standard: Not; Weight: 0.000194oz; Features: Automotive AEC-Q200; Case Code (Imperial): 0805; Radiation Hardening: No; Contact Plating: Tin; Lead Free: Lead Free; Length: 2mm; Termination: Solder

## Nets that join several sheets
GND: Sensors5V (14 pins), MainPowerBoard (19 pins), MotorDriver (10 pins), MCU (10 pins), Rechargeable Circuit (22 pins)
NetC4_2: Sensors5V (C16.2 U3.4 U3.5), MainPowerBoard (6 pins), MotorDriver (7 pins)
NetC11_1: MainPowerBoard (C11.1 L2.2 R5.1), MCU (R20.1 R21.1)
NetMD1_2: MotorDriver (Motor_Driver1.16), MCU (MD1.2)
NetMD1_12: MotorDriver (Motor_Driver1.21), MCU (MD1.12)
NetMD1_13: MotorDriver (Motor_Driver1.22), MCU (MD1.13)
NetMD1_14: MotorDriver (Motor_Driver1.20), MCU (MD1.14)
NetMD1_16: MotorDriver (Motor_Driver1.17), MCU (MD1.16)
NetMD1_26: Sensors5V (U4.12), MCU (MD1.26)
NetMD1_29: Sensors5V (TB1.2), MCU (MD1.29)
NetMD1_30: Sensors5V (TB1.3), MCU (MD1.30)
NetMD1_33: Sensors5V (U4.11), MCU (MD1.33)